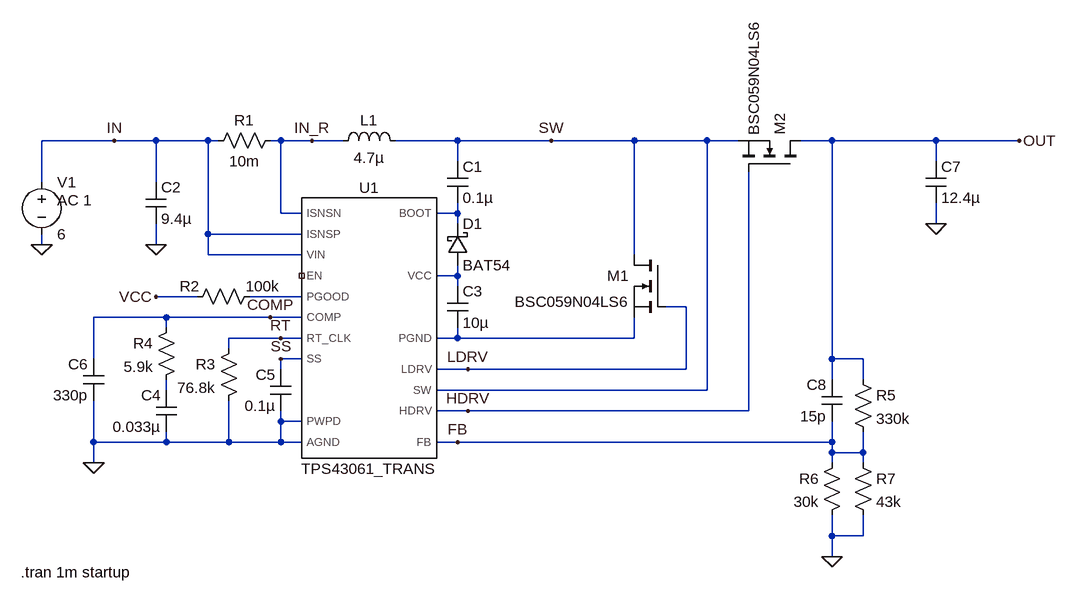
[diagram p0: schematic boost_stage_2.asc]
boost_stage_2.asc, the LTspice schematic file:
Version 4
SHEET 1 1012 680
WIRE -448 -400 -560 -400
WIRE -384 -400 -448 -400
WIRE -304 -400 -384 -400
WIRE -288 -400 -304 -400
WIRE -192 -400 -208 -400
WIRE -144 -400 -192 -400
WIRE -96 -400 -144 -400
WIRE 80 -400 -16 -400
WIRE 224 -400 80 -400
WIRE 352 -400 224 -400
WIRE 464 -400 352 -400
WIRE 512 -400 464 -400
WIRE 656 -400 608 -400
WIRE 816 -400 656 -400
WIRE 944 -400 816 -400
WIRE 80 -368 80 -400
WIRE 816 -368 816 -400
WIRE -560 -336 -560 -400
WIRE -384 -336 -384 -400
WIRE -192 -288 -192 -400
WIRE -160 -288 -192 -288
WIRE 80 -288 80 -304
WIRE 80 -288 48 -288
WIRE 80 -272 80 -288
WIRE 816 -272 816 -304
WIRE -304 -256 -304 -400
WIRE -160 -256 -304 -256
WIRE -560 -240 -560 -256
WIRE -384 -240 -384 -272
WIRE -304 -224 -304 -256
WIRE -160 -224 -304 -224
WIRE 352 -224 352 -400
WIRE 80 -192 80 -208
WIRE 80 -192 48 -192
WIRE 80 -176 80 -192
WIRE -320 -160 -384 -160
WIRE -160 -160 -240 -160
WIRE 432 -144 400 -144
WIRE -368 -128 -480 -128
WIRE -208 -128 -368 -128
WIRE -160 -128 -208 -128
WIRE -368 -112 -368 -128
WIRE -192 -96 -272 -96
WIRE -160 -96 -192 -96
WIRE 80 -96 80 -112
WIRE 80 -96 48 -96
WIRE 352 -96 352 -128
WIRE 352 -96 80 -96
WIRE -272 -80 -272 -96
WIRE -480 -64 -480 -128
WIRE -160 -64 -192 -64
WIRE 656 -64 656 -400
WIRE 704 -64 656 -64
WIRE -192 -48 -192 -64
WIRE 96 -48 48 -48
WIRE 432 -48 432 -144
WIRE 432 -48 96 -48
WIRE 656 -32 656 -64
WIRE 704 -32 704 -64
WIRE -368 -16 -368 -32
WIRE 464 -16 464 -400
WIRE 464 -16 48 -16
WIRE 96 16 48 16
WIRE 528 16 528 -352
WIRE 528 16 96 16
WIRE -192 32 -192 16
WIRE -160 32 -192 32
WIRE -480 64 -480 0
WIRE -368 64 -368 48
WIRE -368 64 -480 64
WIRE -272 64 -272 0
WIRE -272 64 -368 64
WIRE -192 64 -192 32
WIRE -192 64 -272 64
WIRE -160 64 -192 64
WIRE 80 64 48 64
WIRE 656 64 656 32
WIRE 656 64 80 64
WIRE 656 80 656 64
WIRE 704 80 704 48
WIRE 704 80 656 80
WIRE -480 96 -480 64
WIRE 656 96 656 80
WIRE 704 96 704 80
WIRE 656 208 656 176
WIRE 704 208 704 176
WIRE 704 208 656 208
WIRE 656 240 656 208
FLAG -560 -240 0
FLAG -384 -240 0
FLAG -384 -160 VCC
FLAG -448 -400 IN
FLAG -480 96 0
FLAG 944 -400 OUT
FLAG 816 -272 0
FLAG 656 240 0
FLAG 224 -400 SW
FLAG 96 -48 LDRV
FLAG 96 16 HDRV
FLAG 80 64 FB
FLAG -208 -128 COMP
FLAG -192 -96 RT
FLAG -192 -64 SS
FLAG -144 -400 IN_R
SYMBOL nmos 400 -224 M0
SYMATTR InstName M1
SYMATTR Value BSC059N04LS6
SYMBOL schottky 64 -208 M180
WINDOW 0 24 64 Left 2
WINDOW 3 24 0 Left 2
SYMATTR InstName D1
SYMATTR Value BAT54
SYMATTR Description Diode
SYMATTR Type diode
SYMBOL cap 64 -368 R0
SYMATTR InstName C1
SYMATTR Value 0.1µ
SYMBOL TPS43061_TRANS -64 -160 R0
SYMATTR InstName U1
SYMBOL voltage -560 -352 R0
WINDOW 123 24 44 Left 2
WINDOW 39 0 0 Left 0
SYMATTR InstName V1
SYMATTR Value 6
SYMATTR Value2 AC 1
SYMBOL cap -400 -336 R0
SYMATTR InstName C2
SYMATTR Value 9.4µ
SYMBOL res -192 -416 R90
WINDOW 0 0 56 VBottom 2
WINDOW 3 32 56 VTop 2
SYMATTR InstName R1
SYMATTR Value 10m
SYMBOL res -224 -176 R90
WINDOW 0 16 108 VBottom 2
WINDOW 3 16 -4 VBottom 2
SYMATTR InstName R2
SYMATTR Value 100k
SYMBOL ind -112 -384 R270
WINDOW 0 32 56 VTop 2
WINDOW 3 5 56 VBottom 2
SYMATTR InstName L1
SYMATTR Value 4.7µ
SYMATTR SpiceLine Ipk=6.7 Rser=19.5m
SYMBOL cap 64 -176 R0
SYMATTR InstName C3
SYMATTR Value 10µ
SYMBOL nmos 608 -352 M270
SYMATTR InstName M2
SYMATTR Value BSC059N04LS6
SYMBOL cap -176 16 R180
WINDOW 0 24 56 Left 2
WINDOW 3 24 8 Left 2
SYMATTR InstName C5
SYMATTR Value 0.1µ
SYMBOL res -256 -96 M0
SYMATTR InstName R3
SYMATTR Value 76.8k
SYMBOL res -352 -128 M0
SYMATTR InstName R4
SYMATTR Value 5.9k
SYMBOL cap -352 -16 M0
SYMATTR InstName C4
SYMATTR Value 0.033µ
SYMBOL cap -464 0 R180
WINDOW 0 24 56 Left 2
WINDOW 3 24 8 Left 2
SYMATTR InstName C6
SYMATTR Value 330p
SYMBOL cap 800 -368 R0
SYMATTR InstName C7
SYMATTR Value 12.4µ
SYMBOL cap 672 -32 M0
SYMATTR InstName C8
SYMATTR Value 15p
SYMBOL res 688 -48 R0
SYMATTR InstName R5
SYMATTR Value 330k
SYMBOL res 672 80 M0
SYMATTR InstName R6
SYMATTR Value 30k
SYMBOL res 688 80 R0
SYMATTR InstName R7
SYMATTR Value 43k
TEXT -592 264 Left 2 !.tran 1m startup

The netlist it stands for:
* boost_stage_2.asc
M1 SW LDRV N004 N004 BSC059N04LS6
D1 N002 N001 BAT54
C1 SW N001 0.1µ
XU1 0 N001 COMP NC_01 FB HDRV IN_R IN LDRV N004 N003 0 RT SS SW N002 IN TPS43061_TRANS  ; pins AGND BOOT COMP EN FB HDRV ISNSN ISNSP LDRV PGND PGOOD PWPD RT_CLK SS SW VCC VIN
V1 IN 0 6 AC 1
C2 IN 0 9.4µ
R1 IN_R IN 10m
R2 N003 VCC 100k
L1 IN_R SW 4.7µ Ipk=6.7 Rser=19.5m
C3 N002 N004 10µ
M2 OUT HDRV SW SW BSC059N04LS6
C5 0 SS 0.1µ
R3 RT 0 76.8k
R4 COMP N005 5.9k
C4 N005 0 0.033µ
C6 0 COMP 330p
C7 OUT 0 12.4µ
C8 OUT FB 15p
R5 OUT FB 330k
R6 FB 0 30k
R7 FB 0 43k
.model D D
.lib standard.dio
.model NMOS NMOS
.model PMOS PMOS
.lib standard.mos
.tran 1m startup
.lib C:\Users\Tachi\Documents\Nerd Shit\rm_electrical-supercap\SPICE_sims\libraries\TPS43061_TRANS.lib
.backanno
.end